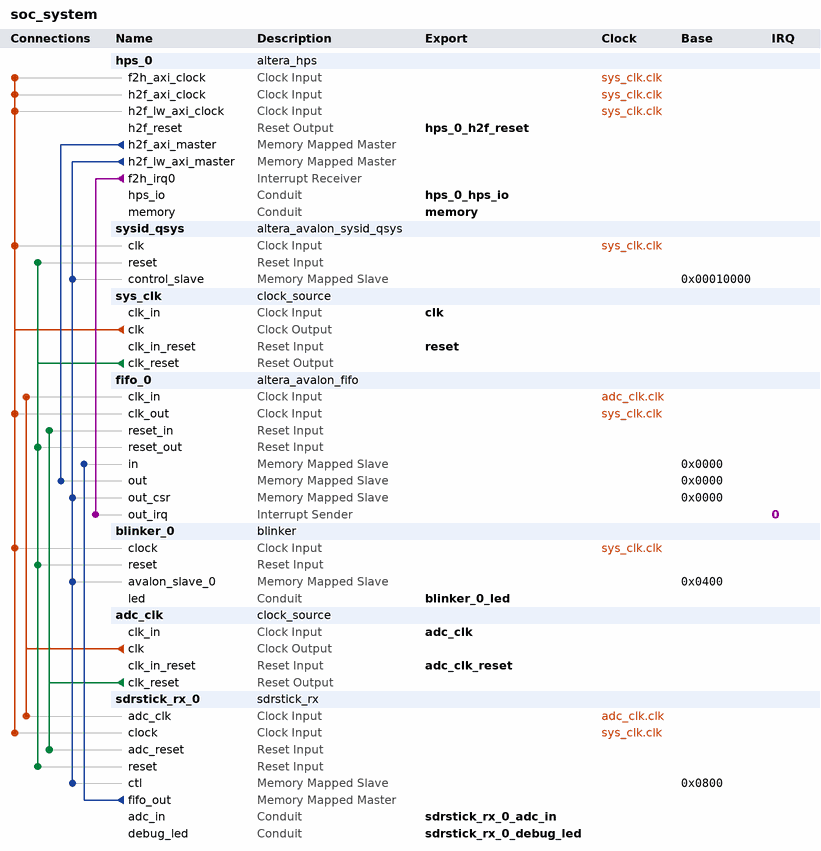
[diagram p0: system contents]
# Platform Designer (Qsys) system soc_system, Cyclone V 5CSXFC6D6F31C8ES
# Parameters at their usual value, and those the tool derives, are not listed.
package require -exact qsys 14.0
create_system soc_system
set_project_property DEVICE_FAMILY {Cyclone V}
set_project_property DEVICE 5CSXFC6D6F31C8ES

add_instance hps_0 altera_hps 14.0
set_instance_parameter_value hps_0 MEM_VENDOR JEDEC
set_instance_parameter_value hps_0 MEM_ROW_ADDR_WIDTH 15
set_instance_parameter_value hps_0 MEM_COL_ADDR_WIDTH 10
set_instance_parameter_value hps_0 MEM_DQ_WIDTH 32
set_instance_parameter_value hps_0 MEM_BANKADDR_WIDTH 3
set_instance_parameter_value hps_0 MEM_DRV_STR RZQ/7
set_instance_parameter_value hps_0 MEM_RTT_NOM RZQ/4
set_instance_parameter_value hps_0 MEM_RTT_WR RZQ/4
set_instance_parameter_value hps_0 MEM_WTCL 8
set_instance_parameter_value hps_0 MEM_TCL 11
set_instance_parameter_value hps_0 TIMING_TIS 180
set_instance_parameter_value hps_0 TIMING_TIH 140
set_instance_parameter_value hps_0 TIMING_TDS 30
set_instance_parameter_value hps_0 TIMING_TDH 65
set_instance_parameter_value hps_0 TIMING_TDQSQ 125
set_instance_parameter_value hps_0 TIMING_TDQSCK 255
set_instance_parameter_value hps_0 TIMING_TQSH 0.4
set_instance_parameter_value hps_0 MEM_TRAS_NS 35.0
set_instance_parameter_value hps_0 MEM_TRCD_NS 13.75
set_instance_parameter_value hps_0 MEM_TRP_NS 13.75
set_instance_parameter_value hps_0 MEM_TRFC_NS 260.0
set_instance_parameter_value hps_0 MEM_TFAW_NS 30.0
set_instance_parameter_value hps_0 REF_CLK_FREQ 25.0
set_instance_parameter_value hps_0 TIMING_BOARD_MAX_CK_DELAY 0.03
set_instance_parameter_value hps_0 TIMING_BOARD_MAX_DQS_DELAY 0.02
set_instance_parameter_value hps_0 TIMING_BOARD_SKEW_CKDQS_DIMM_MIN 0.09
set_instance_parameter_value hps_0 TIMING_BOARD_SKEW_CKDQS_DIMM_MAX 0.16
set_instance_parameter_value hps_0 TIMING_BOARD_SKEW_WITHIN_DQS 0.01
set_instance_parameter_value hps_0 TIMING_BOARD_SKEW_BETWEEN_DQS 0.08
set_instance_parameter_value hps_0 TIMING_BOARD_DQ_TO_DQS_SKEW 0.0
set_instance_parameter_value hps_0 TIMING_BOARD_AC_SKEW 0.03
set_instance_parameter_value hps_0 TIMING_BOARD_AC_TO_CK_SKEW 0.0
set_instance_parameter_value hps_0 MEM_CLK_FREQ 300.0
set_instance_parameter_value hps_0 HPS_PROTOCOL DDR3
set_instance_parameter_value hps_0 desired_cfg_clk_mhz 100.0
set_instance_parameter_value hps_0 desired_qspi_clk_mhz 400.0
set_instance_parameter_value hps_0 STM_Enable false
set_instance_parameter_value hps_0 F2S_Width 1
set_instance_parameter_value hps_0 S2F_Width 1
set_instance_parameter_value hps_0 LWH2F_Enable true
set_instance_parameter_value hps_0 F2SCLK_DBGRST_Enable false
set_instance_parameter_value hps_0 F2SCLK_WARMRST_Enable false
set_instance_parameter_value hps_0 F2SCLK_COLDRST_Enable false
set_instance_parameter_value hps_0 F2SINTERRUPT_Enable true
set_instance_parameter_value hps_0 EMAC1_PinMuxing {HPS I/O Set 0}
set_instance_parameter_value hps_0 EMAC1_Mode RGMII
set_instance_parameter_value hps_0 QSPI_PinMuxing {HPS I/O Set 0}
set_instance_parameter_value hps_0 QSPI_Mode {1 SS}
set_instance_parameter_value hps_0 SDIO_PinMuxing {HPS I/O Set 0}
set_instance_parameter_value hps_0 SDIO_Mode {4-bit Data}
set_instance_parameter_value hps_0 USB1_PinMuxing {HPS I/O Set 0}
set_instance_parameter_value hps_0 USB1_Mode SDR
set_instance_parameter_value hps_0 SPIM0_PinMuxing {HPS I/O Set 0}
set_instance_parameter_value hps_0 SPIM0_Mode {Single Slave Select}
set_instance_parameter_value hps_0 SPIM1_PinMuxing {HPS I/O Set 0}
set_instance_parameter_value hps_0 SPIM1_Mode {Single Slave Select}
set_instance_parameter_value hps_0 UART0_PinMuxing {HPS I/O Set 0}
set_instance_parameter_value hps_0 UART0_Mode {No Flow Control}
set_instance_parameter_value hps_0 I2C0_PinMuxing Unused
set_instance_parameter_value hps_0 I2C0_Mode N/A
set_instance_parameter_value hps_0 I2C1_PinMuxing {HPS I/O Set 0}
set_instance_parameter_value hps_0 I2C1_Mode I2C
set_instance_parameter_value hps_0 FPGA_PERIPHERAL_OUTPUT_CLOCK_FREQ_EMAC0_MD_CLK 100
set_instance_parameter_value hps_0 FPGA_PERIPHERAL_OUTPUT_CLOCK_FREQ_EMAC0_GTX_CLK 100
set_instance_parameter_value hps_0 FPGA_PERIPHERAL_OUTPUT_CLOCK_FREQ_EMAC1_MD_CLK 100
set_instance_parameter_value hps_0 FPGA_PERIPHERAL_OUTPUT_CLOCK_FREQ_EMAC1_GTX_CLK 100

add_instance sysid_qsys altera_avalon_sysid_qsys 14.0
set_instance_parameter_value sysid_qsys id 267320588

add_instance sys_clk clock_source 14.0
set_instance_parameter_value sys_clk clockFrequency 50000000

add_instance fifo_0 altera_avalon_fifo 14.0
set_instance_parameter_value fifo_0 bitsPerSymbol 8
set_instance_parameter_value fifo_0 channelWidth 8
set_instance_parameter_value fifo_0 errorWidth 8
set_instance_parameter_value fifo_0 fifoDepth 2048
set_instance_parameter_value fifo_0 fifoInputInterfaceOptions AVALONMM_WRITE
set_instance_parameter_value fifo_0 fifoOutputInterfaceOptions AVALONMM_READ
set_instance_parameter_value fifo_0 singleClockMode false
set_instance_parameter_value fifo_0 symbolsPerBeat 2
set_instance_parameter_value fifo_0 useBackpressure false
set_instance_parameter_value fifo_0 useIRQ true
set_instance_parameter_value fifo_0 usePacket true
set_instance_parameter_value fifo_0 useReadControl true
set_instance_parameter_value fifo_0 useWriteControl false

add_instance blinker_0 blinker 1.0

add_instance adc_clk clock_source 14.0
set_instance_parameter_value adc_clk clockFrequency 122880000

add_instance sdrstick_rx_0 sdrstick_rx 1.0

# connections
add_connection adc_clk.clk fifo_0.clk_in clock
add_connection adc_clk.clk sdrstick_rx_0.adc_clk clock
add_connection sys_clk.clk blinker_0.clock clock
add_connection sys_clk.clk fifo_0.clk_out clock
add_connection sys_clk.clk hps_0.f2h_axi_clock clock
add_connection sys_clk.clk hps_0.h2f_axi_clock clock
add_connection sys_clk.clk hps_0.h2f_lw_axi_clock clock
add_connection sys_clk.clk sdrstick_rx_0.clock clock
add_connection sys_clk.clk sysid_qsys.clk clock
add_connection adc_clk.clk_reset fifo_0.reset_in reset
add_connection adc_clk.clk_reset sdrstick_rx_0.adc_reset reset
add_connection sys_clk.clk_reset blinker_0.reset reset
add_connection sys_clk.clk_reset fifo_0.reset_out reset
add_connection sys_clk.clk_reset sdrstick_rx_0.reset reset
add_connection sys_clk.clk_reset sysid_qsys.reset reset
add_connection hps_0.h2f_axi_master fifo_0.out avalon
set_connection_parameter_value hps_0.h2f_axi_master/fifo_0.out baseAddress 0x0000
add_connection hps_0.h2f_lw_axi_master blinker_0.avalon_slave_0 avalon
set_connection_parameter_value hps_0.h2f_lw_axi_master/blinker_0.avalon_slave_0 baseAddress 0x0400
add_connection hps_0.h2f_lw_axi_master fifo_0.out_csr avalon
set_connection_parameter_value hps_0.h2f_lw_axi_master/fifo_0.out_csr baseAddress 0x0000
add_connection hps_0.h2f_lw_axi_master sdrstick_rx_0.ctl avalon
set_connection_parameter_value hps_0.h2f_lw_axi_master/sdrstick_rx_0.ctl baseAddress 0x0800
add_connection hps_0.h2f_lw_axi_master sysid_qsys.control_slave avalon
set_connection_parameter_value hps_0.h2f_lw_axi_master/sysid_qsys.control_slave baseAddress 0x00010000
add_connection sdrstick_rx_0.fifo_out fifo_0.in avalon
set_connection_parameter_value sdrstick_rx_0.fifo_out/fifo_0.in baseAddress 0x0000
add_connection hps_0.f2h_irq0 fifo_0.out_irq interrupt
set_connection_parameter_value hps_0.f2h_irq0/fifo_0.out_irq irqNumber 0

# exported interfaces
add_interface clk clock sink
set_interface_property clk EXPORT_OF sys_clk.clk_in
add_interface reset reset sink
set_interface_property reset EXPORT_OF sys_clk.clk_in_reset
add_interface memory conduit end
set_interface_property memory EXPORT_OF hps_0.memory
add_interface hps_0_hps_io conduit end
set_interface_property hps_0_hps_io EXPORT_OF hps_0.hps_io
add_interface hps_0_h2f_reset reset source
set_interface_property hps_0_h2f_reset EXPORT_OF hps_0.h2f_reset
add_interface blinker_0_led conduit end
set_interface_property blinker_0_led EXPORT_OF blinker_0.led
add_interface adc_clk clock sink
set_interface_property adc_clk EXPORT_OF adc_clk.clk_in
add_interface adc_clk_reset reset sink
set_interface_property adc_clk_reset EXPORT_OF adc_clk.clk_in_reset
add_interface sdrstick_rx_0_adc_in conduit end
set_interface_property sdrstick_rx_0_adc_in EXPORT_OF sdrstick_rx_0.adc_in
add_interface sdrstick_rx_0_debug_led conduit end
set_interface_property sdrstick_rx_0_debug_led EXPORT_OF sdrstick_rx_0.debug_led

set_interconnect_requirement {$system} qsys_mm.clockCrossingAdapter HANDSHAKE
set_interconnect_requirement {$system} qsys_mm.maxAdditionalLatency 1

save_system soc_system.qsys
